# EasyEDA schematic LcsNodes-Base-Station-Board-B.00.01.json

## Sheets
1 Dual Power Module: TITLE: LcsNodes-base-Station-Board\nDual Power Unit - L6205; REV: B.00.01; Date: 2023-06-07; Sheet: 3/5; Drawn By: helmut-f; Company: Your Company
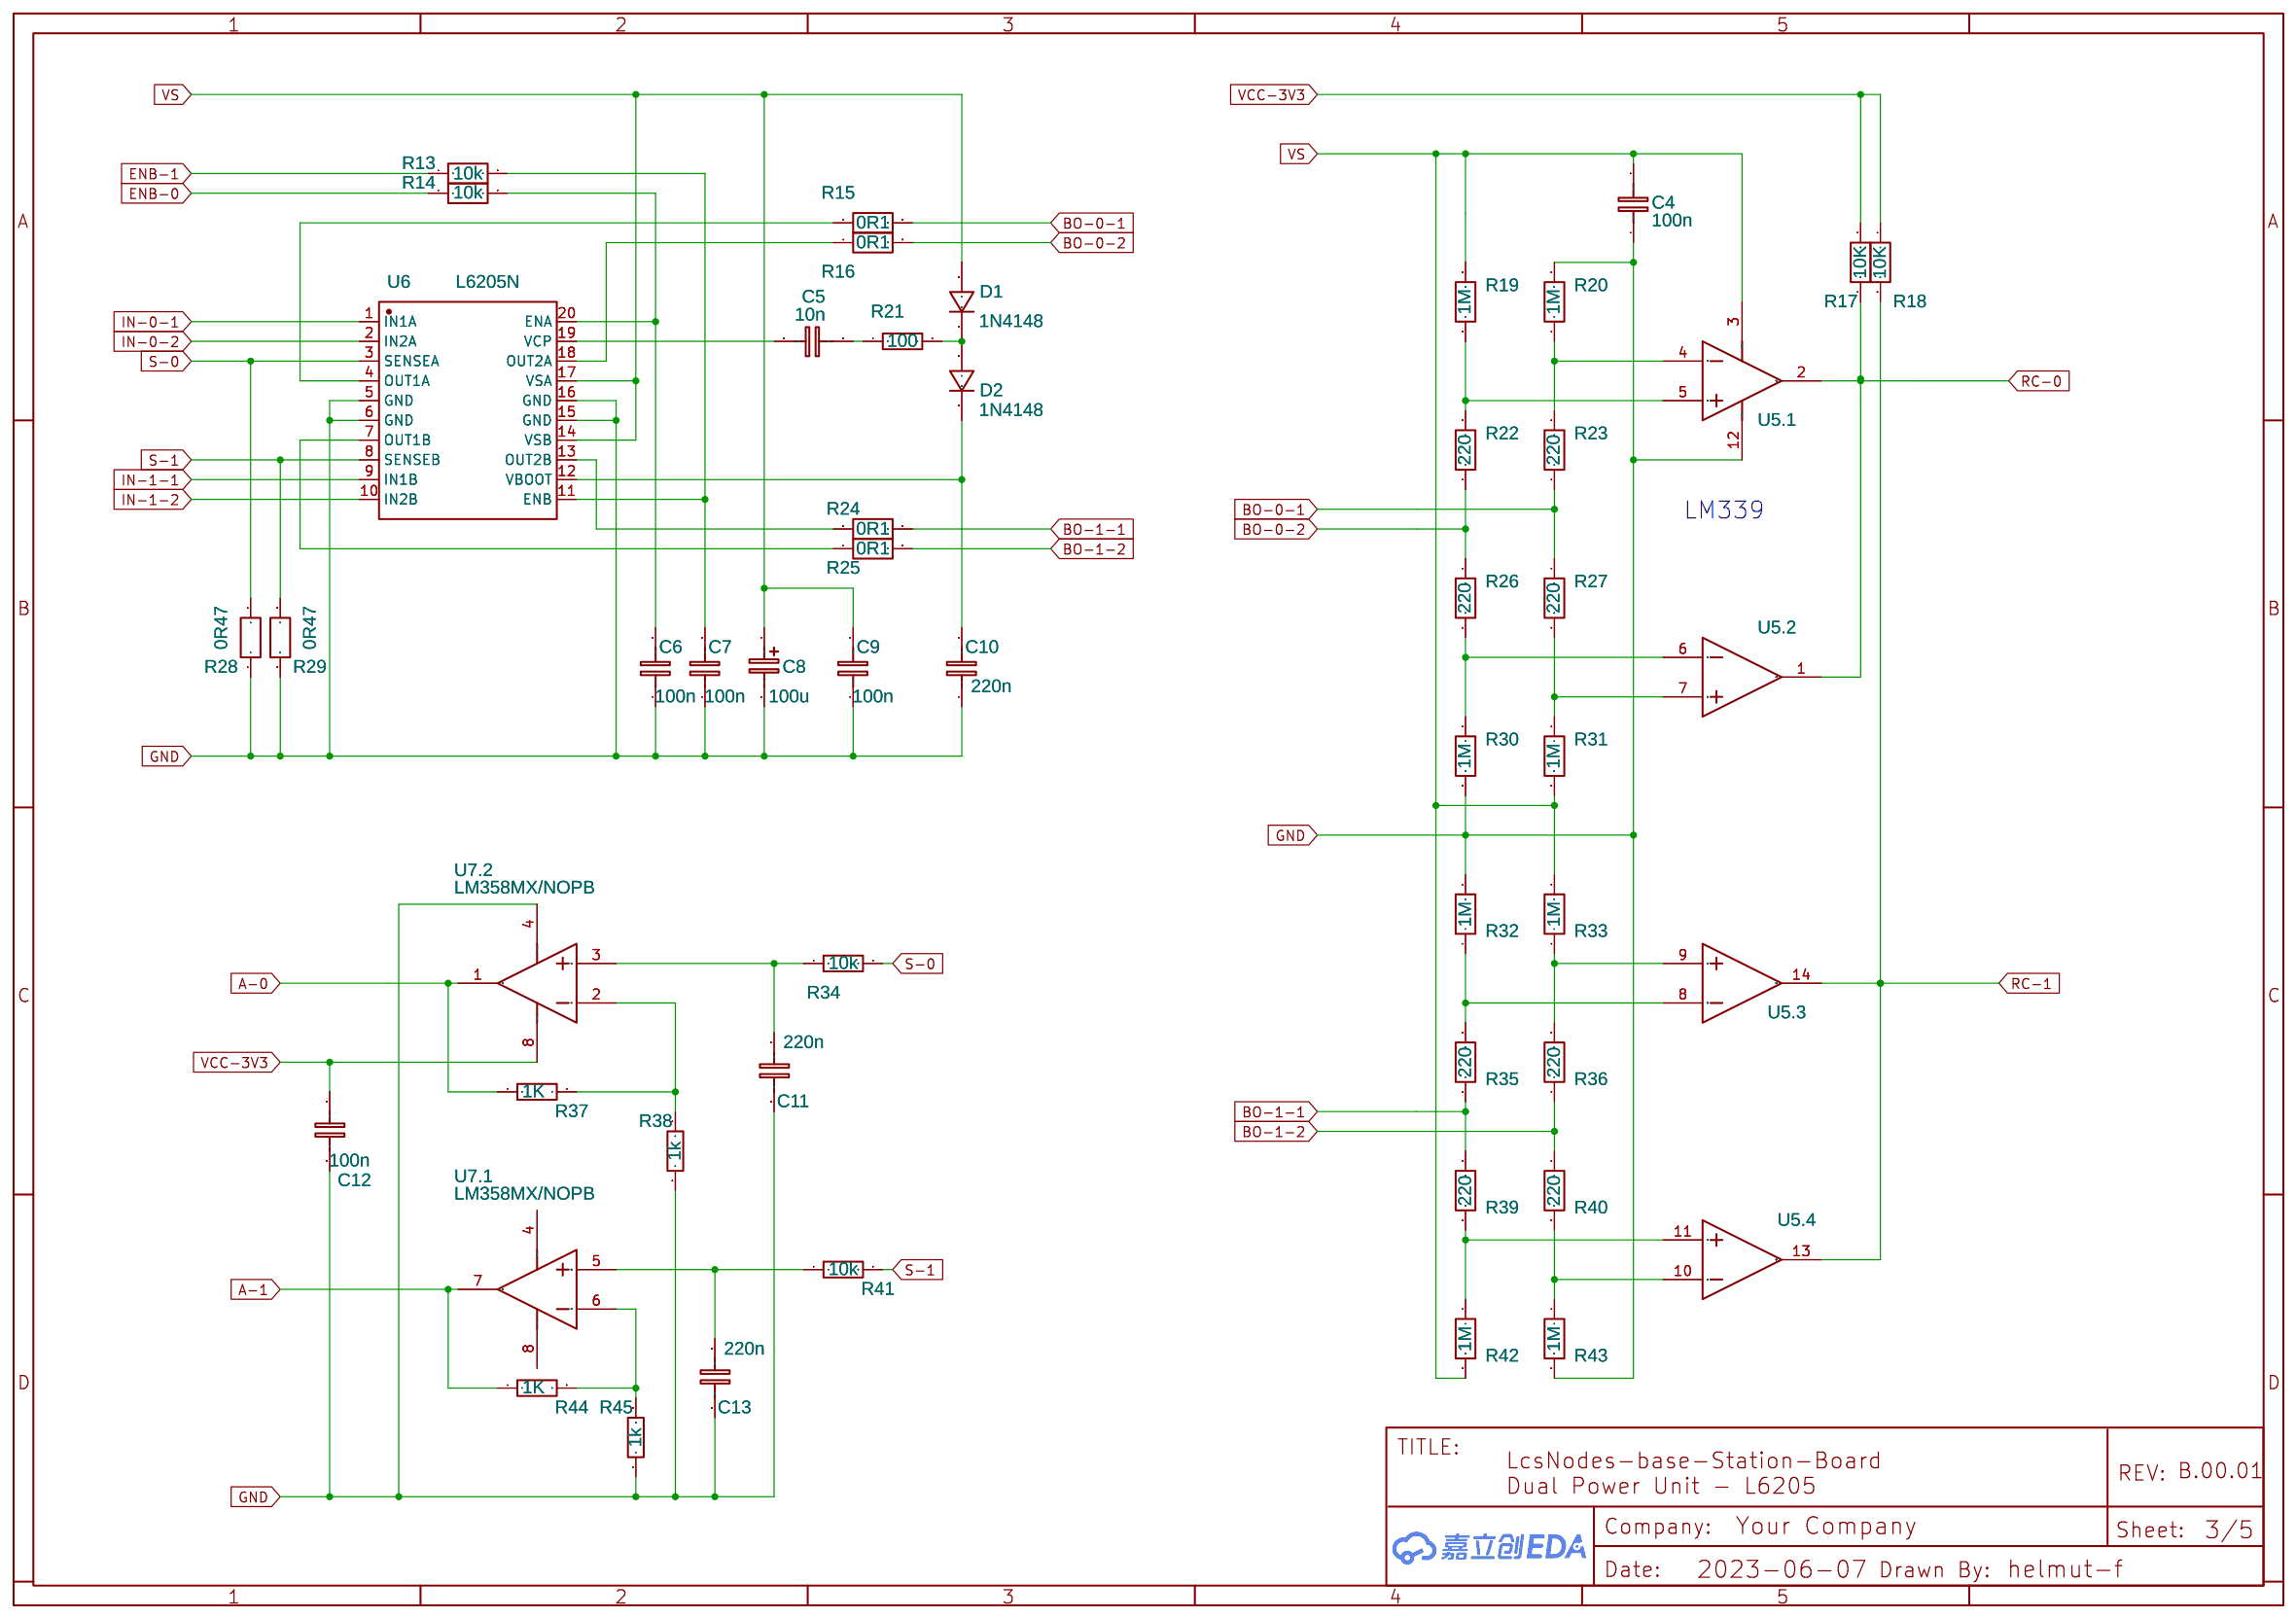
[diagram p0: Dual Power Module]
2 High Level Schematic: TITLE: LcsNodes-Base-Station-Board\nHigh Level Schematic; Sheet: 1/5
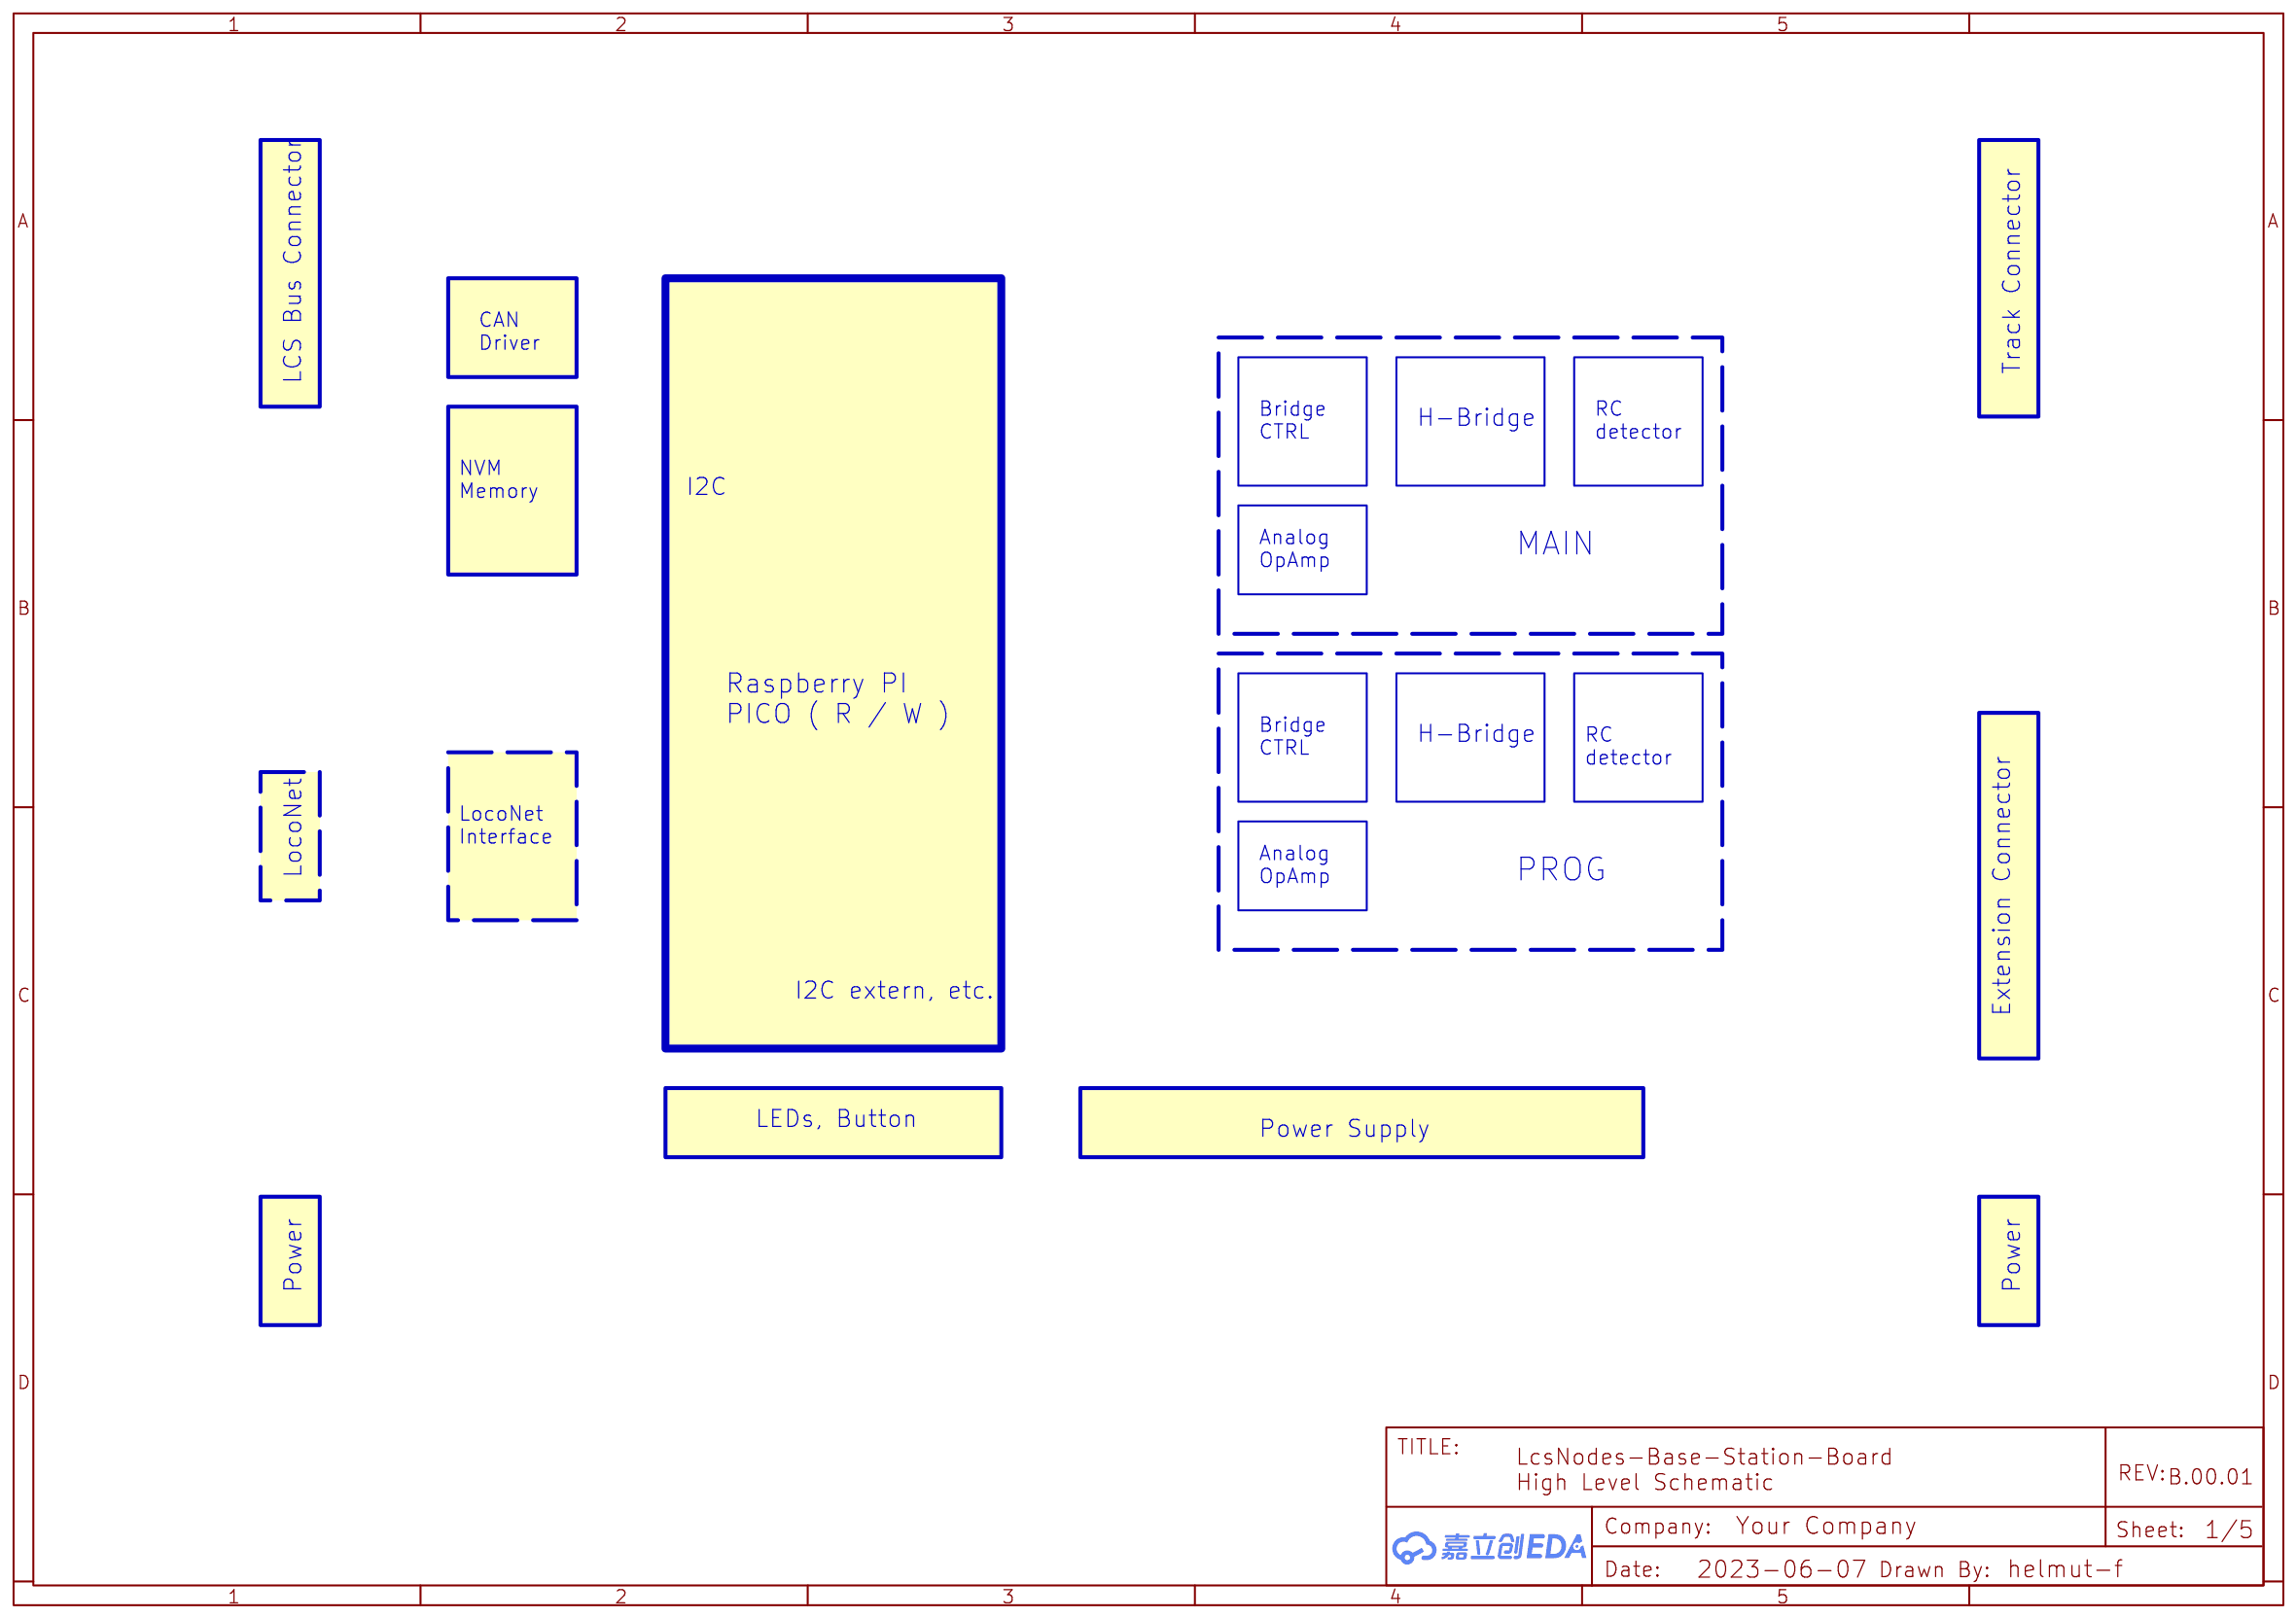
[diagram p1: High Level Schematic]
3 Controller: TITLE: LcsNodes-base-Station-Board\nLogic; Sheet: 2/5
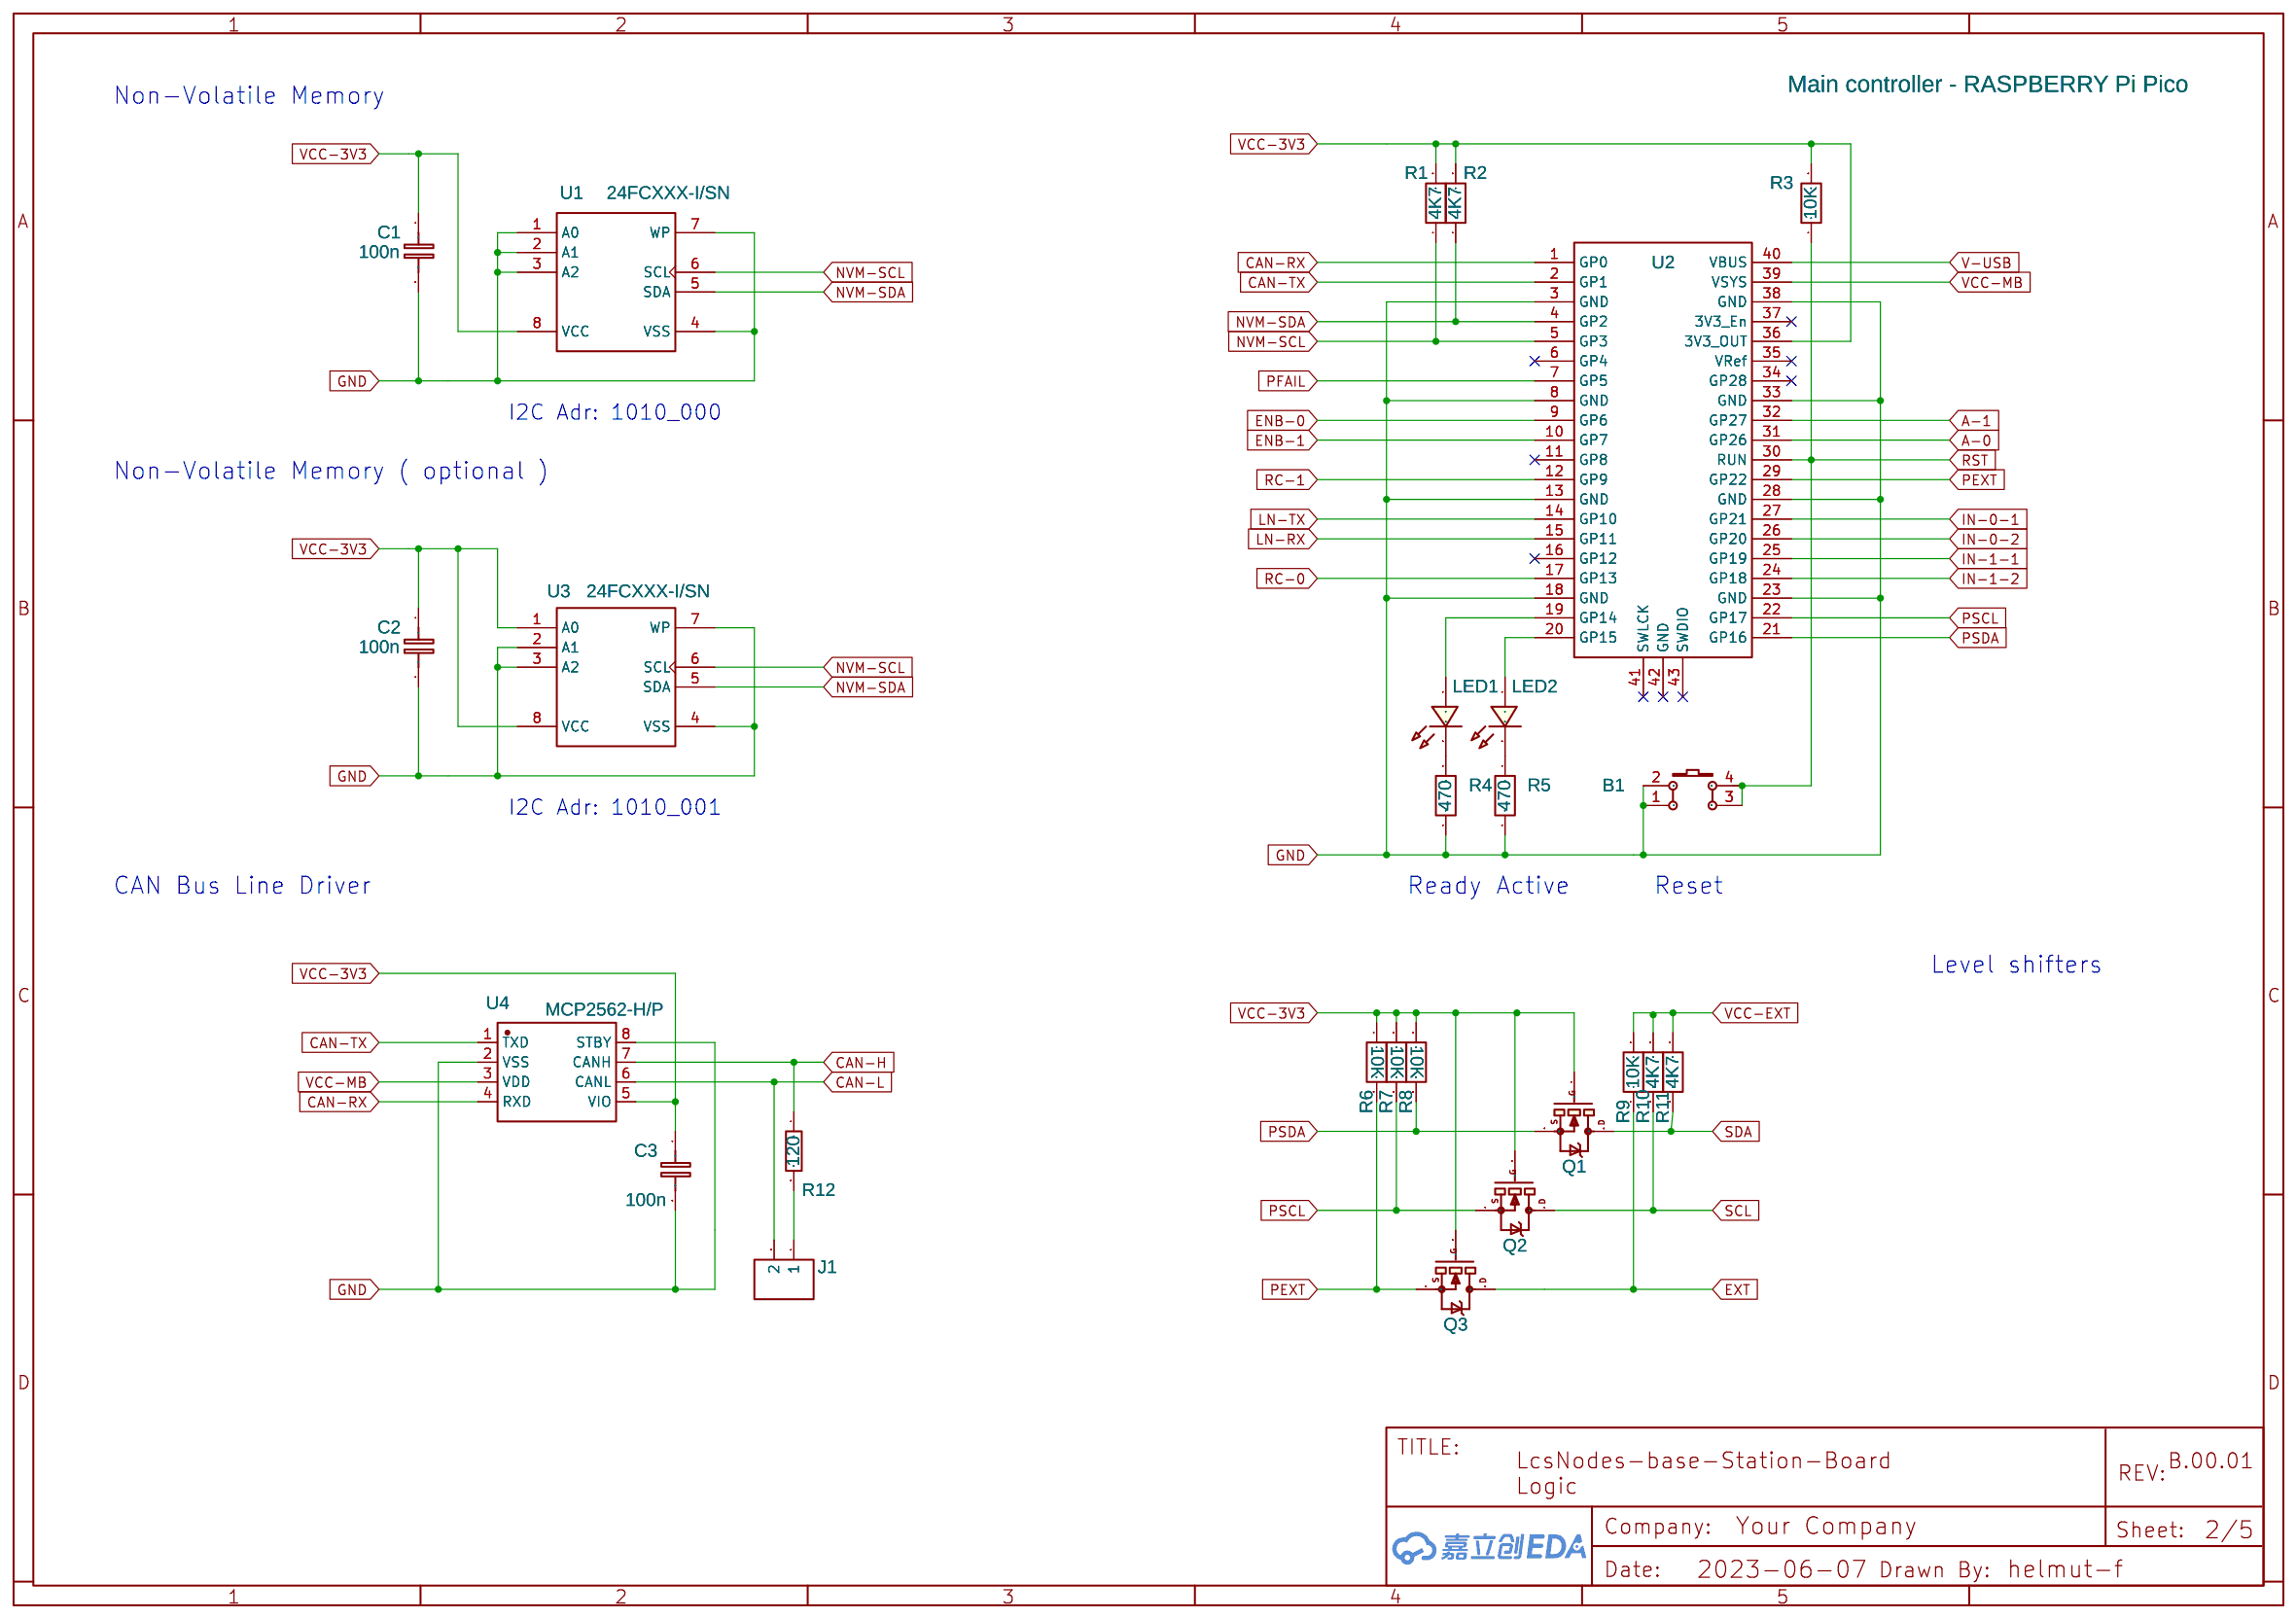
[diagram p2: Controller]
4 Connectors, Power Supply: TITLE: LcsNodes-base-Station-Board\nConnectors, Power Supply; Sheet: 5/5
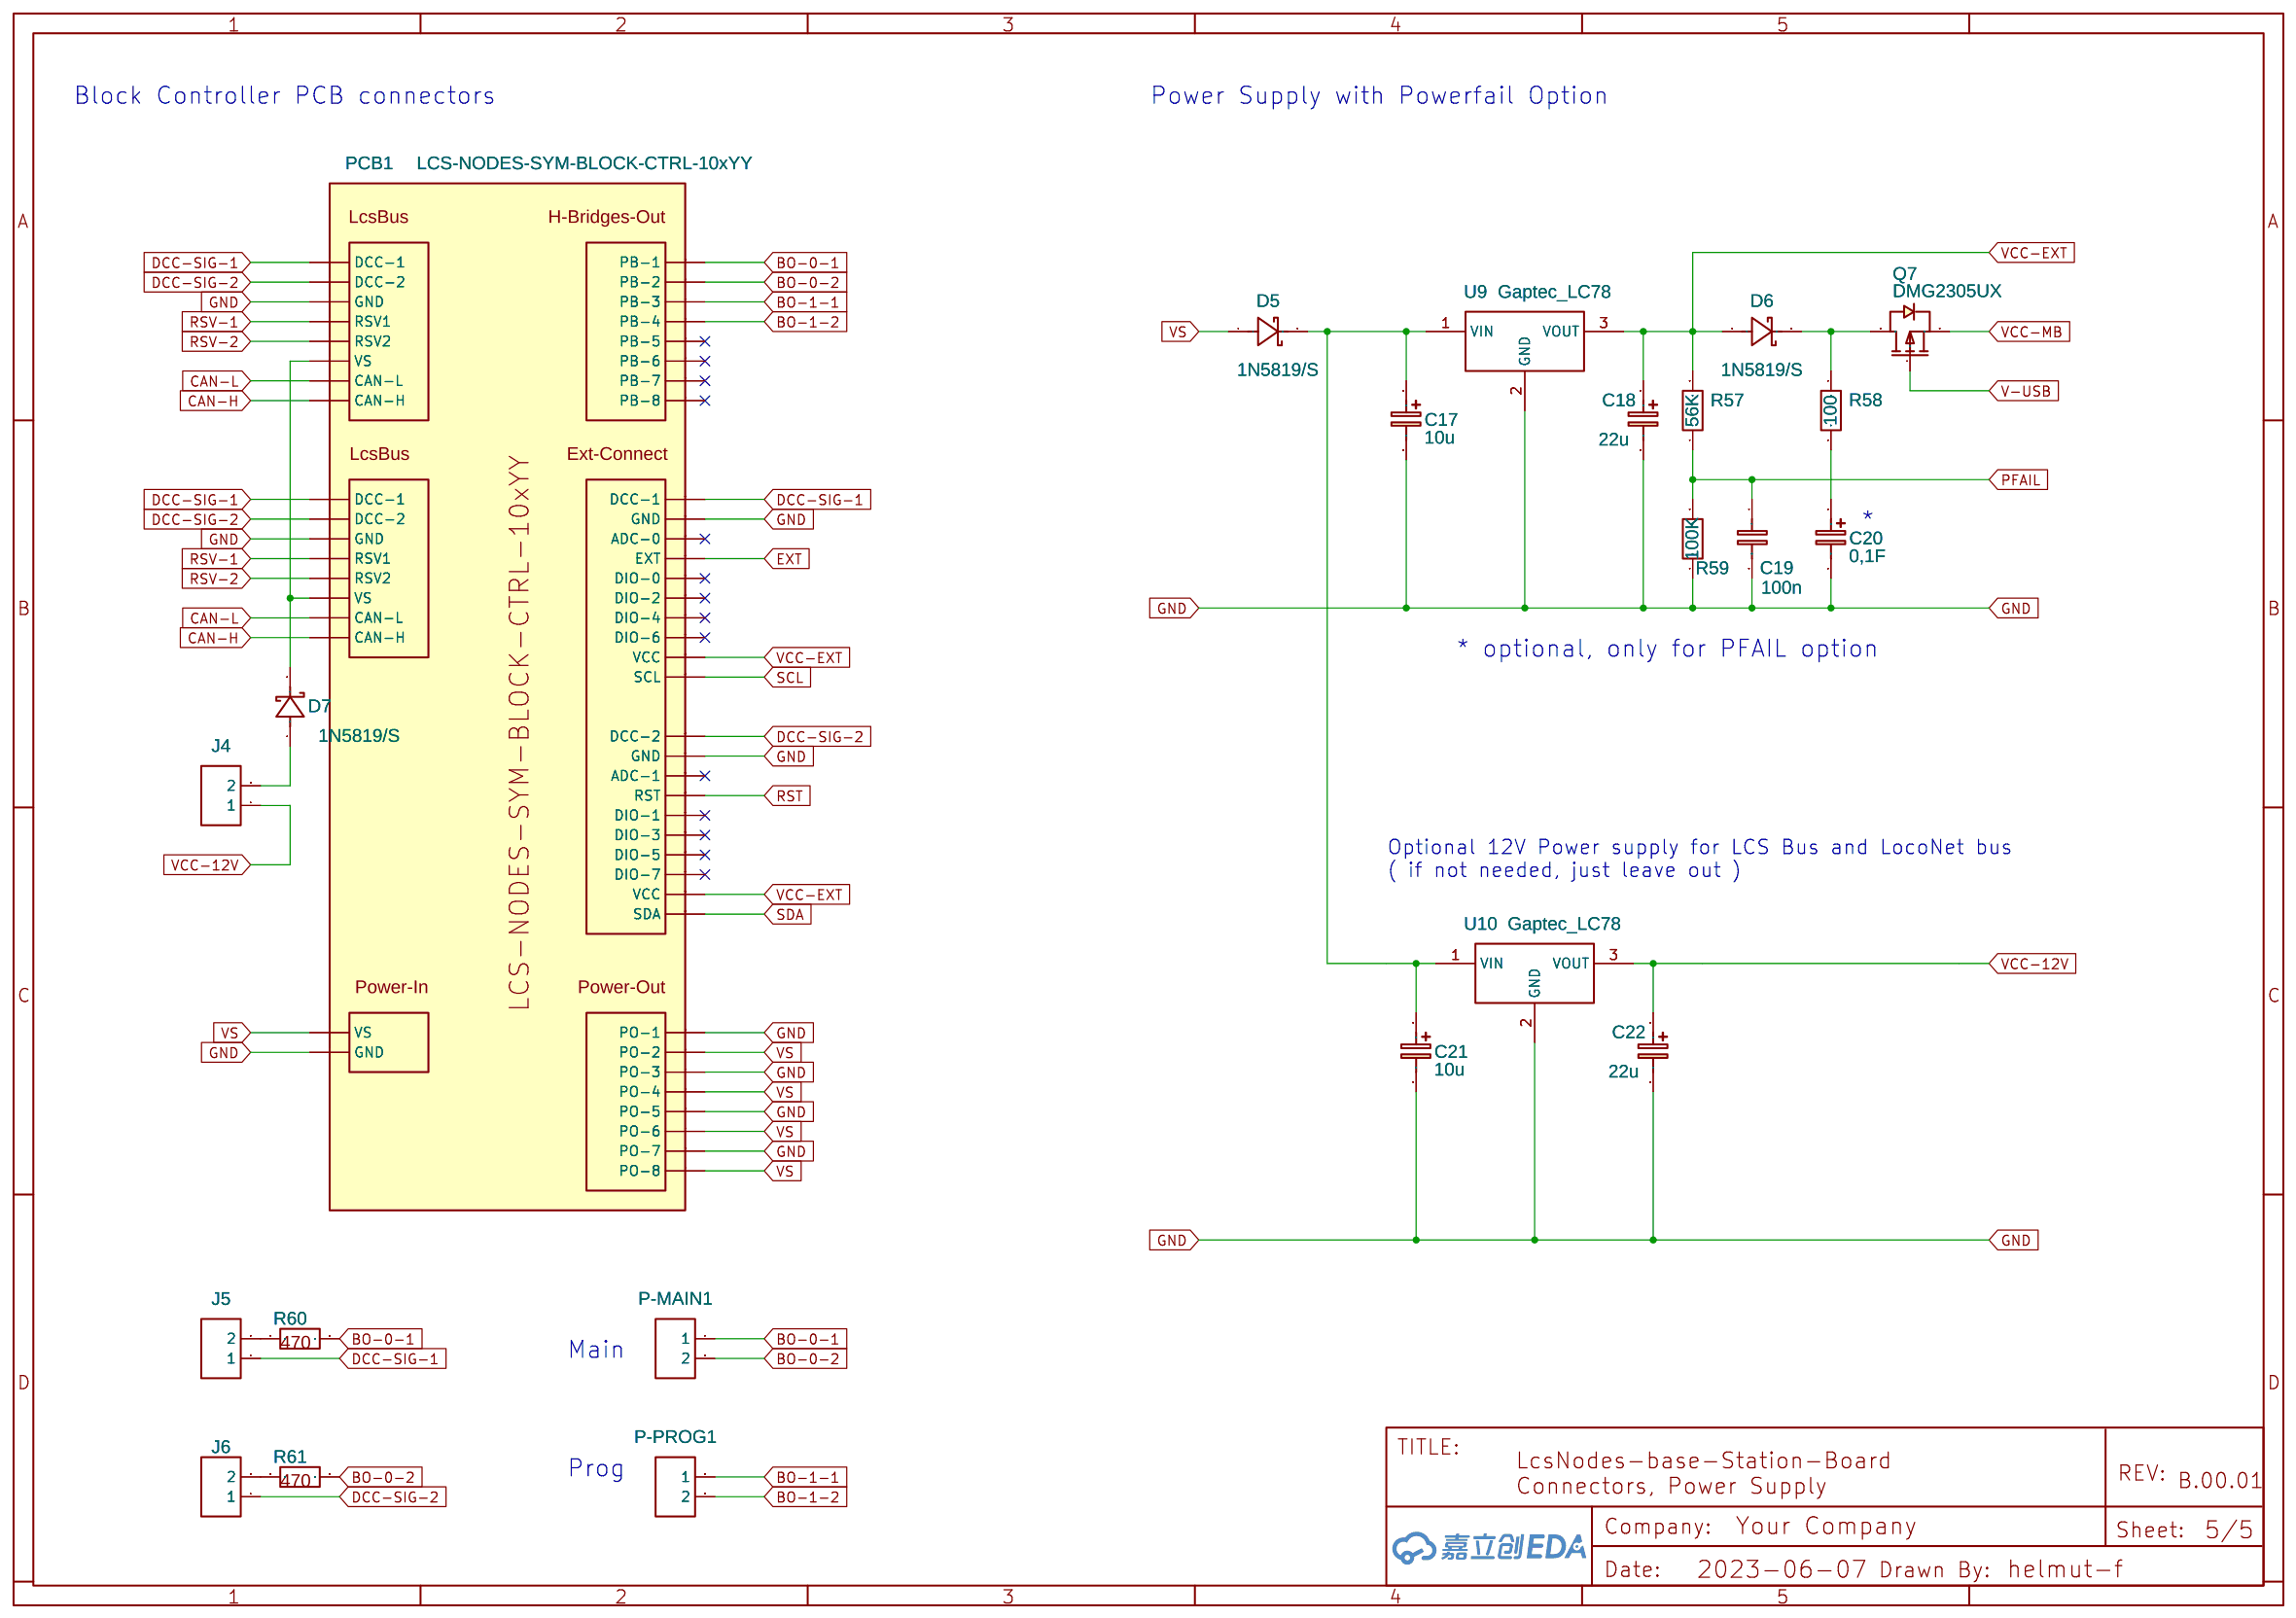
[diagram p3: Connectors, Power Supply]
5 LocoNet Interface: TITLE: LocoNet Interface; REV: 1.0; Date: 2023-09-27; Sheet: 4/5
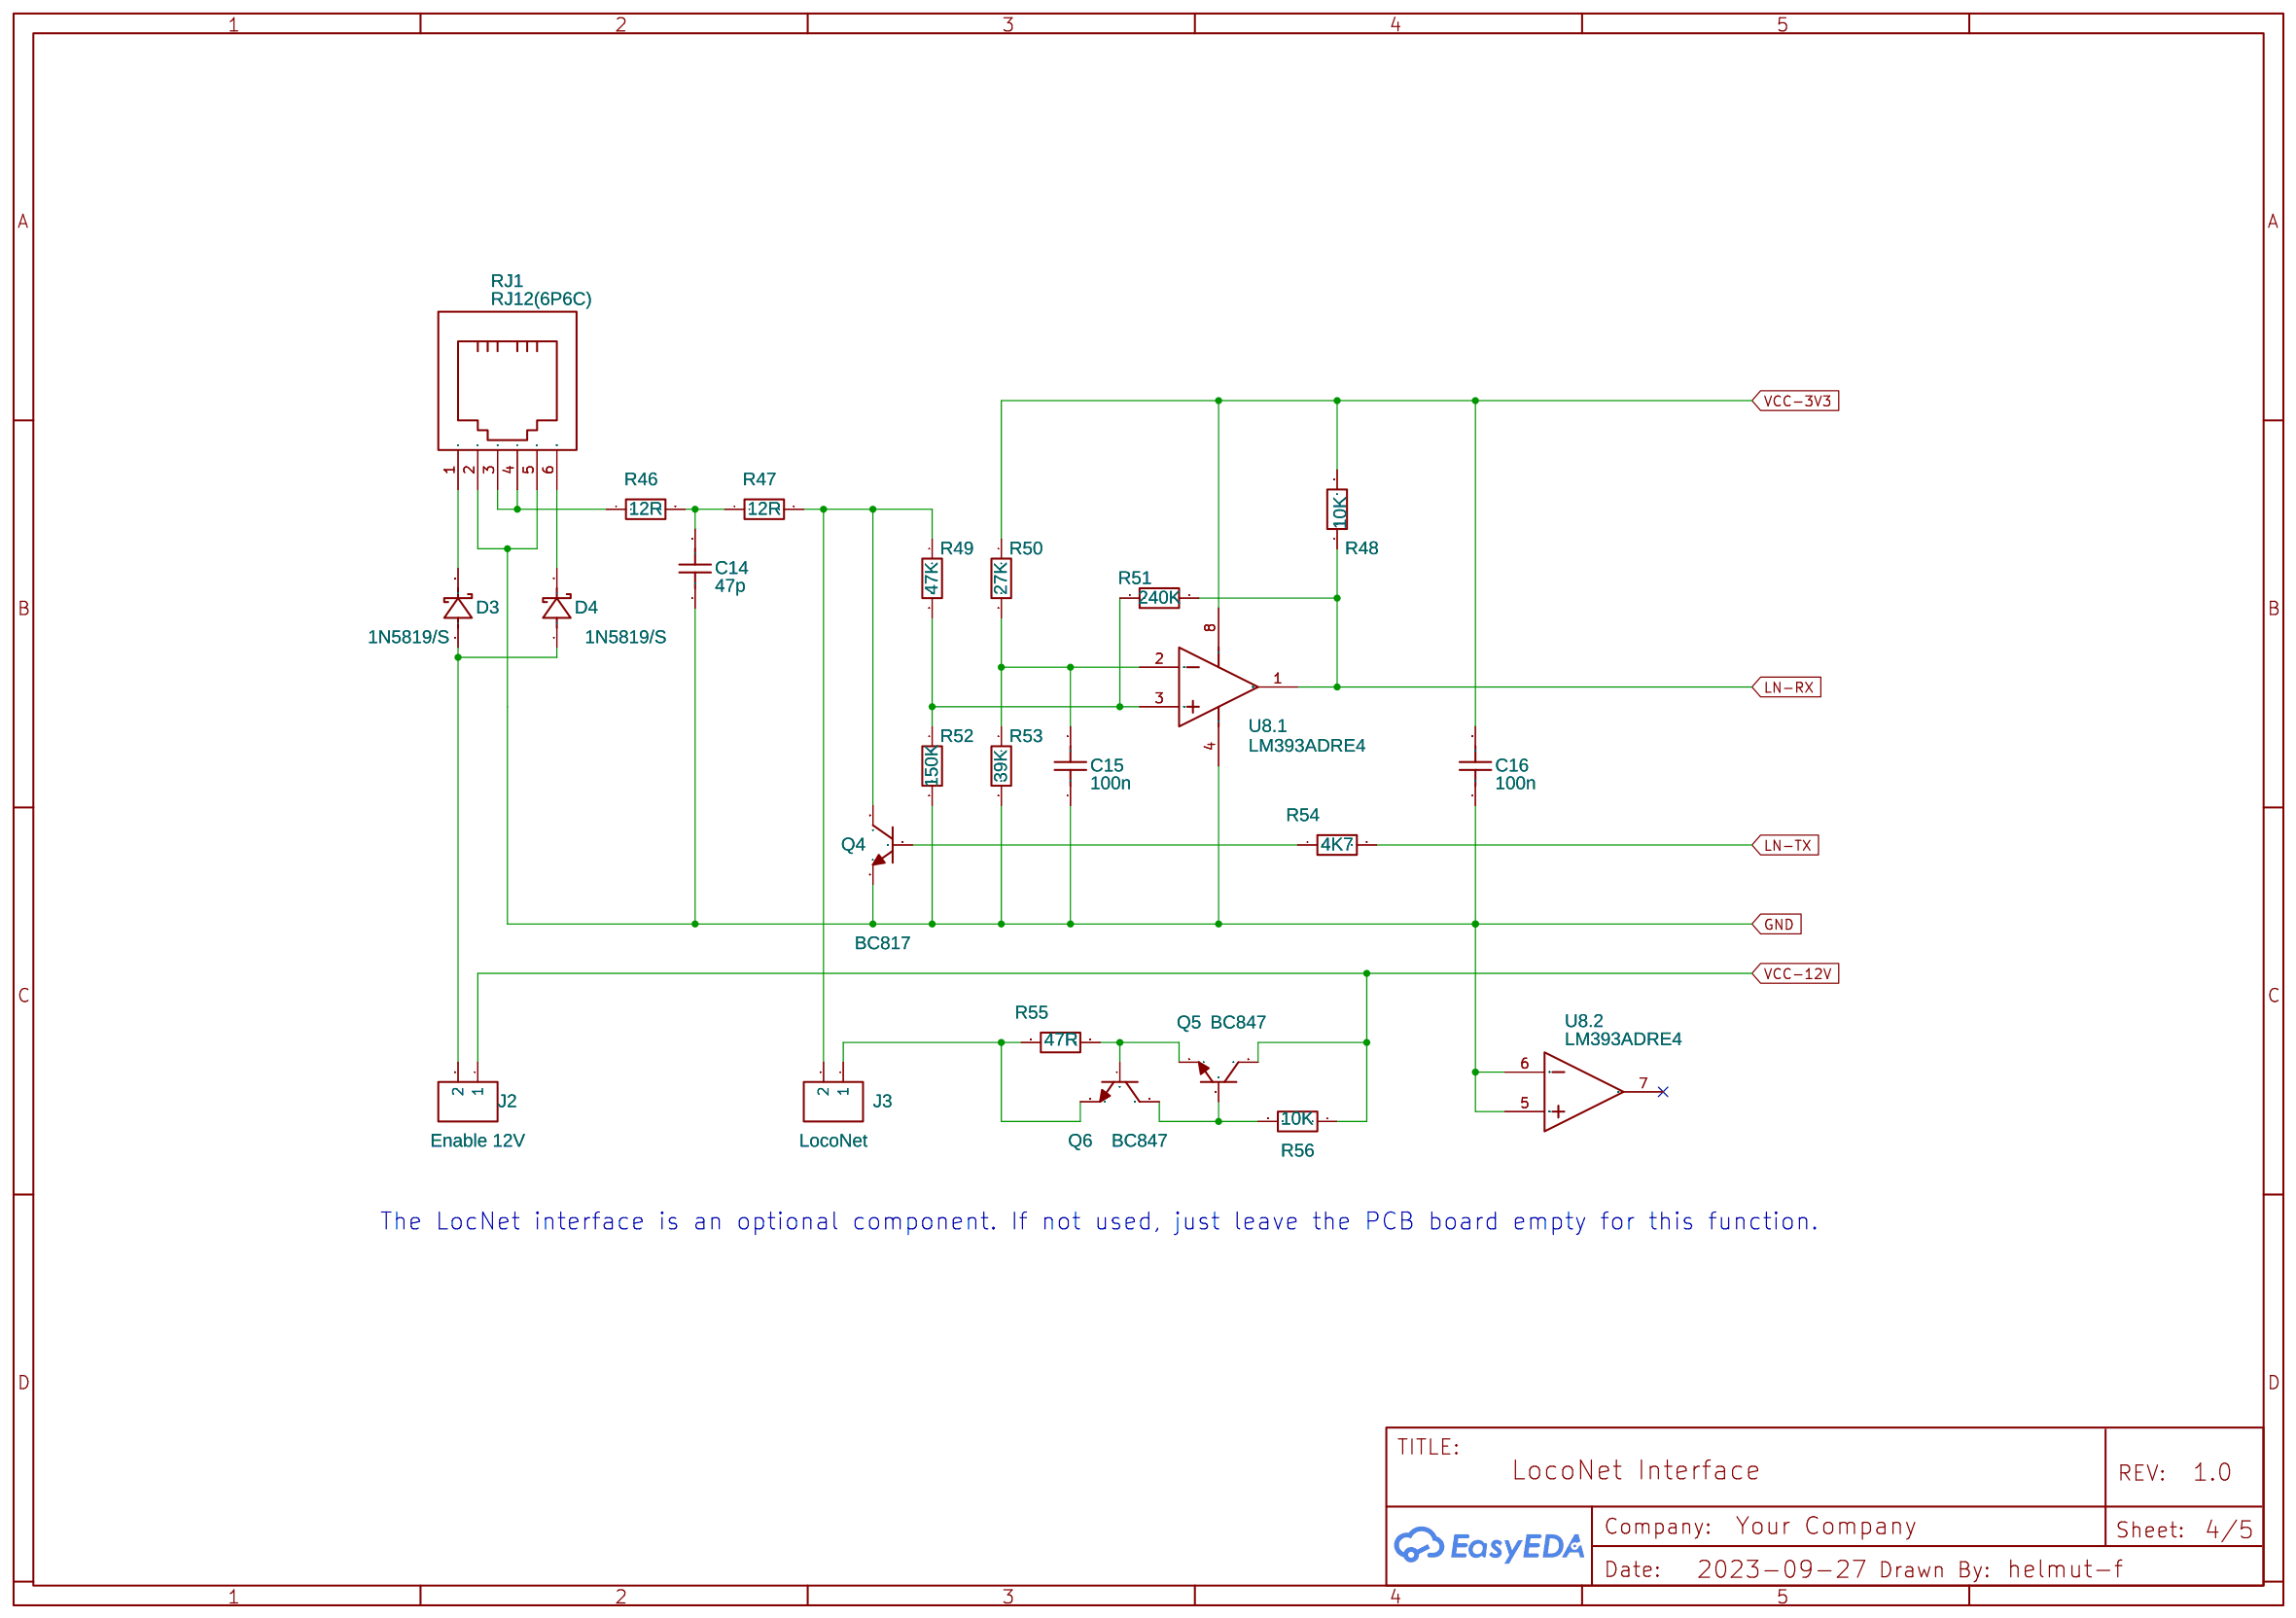
[diagram p4: LocoNet Interface]

## Parts
sheet Connectors, Power Supply
C17  10u  [CAP-D5.0×H5.5]
C18  22u  [CAP-D5.0×H5.5]
C19  100n  [C1206]
C20  0,1F  [CAP-D12.5XF5.0]
C21  10u  [CAP-D5.0×H5.5]
C22  22u  [CAP-D5.0×H5.5]
D5  1N5819/S  [SMA_L4.3-W2.6-LS5.2-R-RD]
D6  1N5819/S  [SMA_L4.3-W2.6-LS5.2-R-RD]
D7  1N5819/S  [SMA_L4.3-W2.6-LS5.2-R-RD]
J4  HDR-M-2.54_1x2  [HDR-M-2.54_1X2]
J5  HDR-M-2.54_1x2  [HDR-M-2.54_1X2]
J6  HDR-M-2.54_1x2  [HDR-M-2.54_1X2]
P-MAIN1  CONN-TH_2P-P5.08  [CONN-TH_2P-P5.08]
P-PROG1  CONN-TH_2P-P5.08  [CONN-TH_2P-P5.08]
PCB1  LCS-NODES-SYM-BLOCK-CTRL-10xYY  [LCS-NODES-FP-MAIN-CTRL-10X12]
Q7  DMG2305UX  [SOT-23-3_L2.9-W1.3-P0.95-LS2.4-BR-1]
R57  56K  [R1206]
R58  100  [R1206]
R59  100K  [R1206]
R60  470Ohm MELF resistor  [10 OHM MELF RESISTOR]
R61  10Ohm MELF resistor  [10 OHM MELF RESISTOR]
U9  Gaptec_LC78  [GAPTEC_LC78]
U10  Gaptec_LC78  [GAPTEC_LC78]
sheet Controller
B1  Opt  [SW-SMD_4P-L6.0-W6.0-P4.50-LS9.0_C23873]
C1  100n  [C1206]
C2  100n  [C1206]
C3  100n  [C1206]
J1  HDR-M-2.54_1x2  [HDR-M-2.54_1X2]
LED1  LED-0603_R  [LED-1206]
LED2  LED-0805_G  [LED-1206]
Q1  MOSFET-NCHANNELBSS138  [SOT23-3]
Q2  MOSFET-NCHANNELBSS138  [SOT23-3]
Q3  MOSFET-NCHANNELBSS138  [SOT23-3]
R1  4K7  [R1206]
R2  4K7  [R1206]
R3  10K  [R1206]
R4  470  [R1206]
R5  470  [R1206]
R6  10K  [R1206]
R7  10K  [R1206]
R8  10K  [R1206]
R9  10K  [R1206]
R10  4K7  [R1206]
R11  4K7  [R1206]
R12  120  [R1206]
U1  24FCXXX-I/SN  [SOIC-8_L4.9-W3.9-P1.27-LS6.0-BL]
U2  Main controller - RASPBERRY Pi Pico  [RASPBERRY PI PICO]
U3  24FCXXX-I/SN  [SOIC-8_L4.9-W3.9-P1.27-LS6.0-BL]
U4  MCP2562-H/P  [SOIC-8_L4.9-W3.9-P1.27-LS6.1-BL]
sheet Dual Power Module
C4  100n  [C1206]
C5  10n  [C1206]
C6  100n  [C1206]
C7  100n  [C1206]
C8  100u  [CAP-D6.3×H7.7]
C9  100n  [C1206]
C10  220n  [C1206]
C11  220n  [C1206]
C12  100n  [C1206]
C13  220n  [C1206]
D1  1N4148  [SOD-80C_L3.3-W1.5-RD]
D2  1N4148  [SOD-80C_L3.3-W1.5-RD]
R13  10k  [R1206]
R14  10k  [R1206]
R15  0R1  [R_AXIAL-0.8]
R16  0R1  [R_AXIAL-0.8]
R17  10K  [R1206]
R18  10K  [R1206]
R19  1M  [R1206]
R20  1M  [R1206]
R21  100  [R1206]
R22  220  [R1206]
R23  220  [R1206]
R24  0R1  [R_AXIAL-0.8]
R25  0R1  [R_AXIAL-0.8]
R26  220  [R1206]
R27  220  [R1206]
R28  0R47  [R_AXIAL-0.8]
R29  0R47  [R_AXIAL-0.8]
R30  1M  [R1206]
R31  1M  [R1206]
R32  1M  [R1206]
R33  1M  [R1206]
R34  10k  [R1206]
R35  220  [R1206]
R36  220  [R1206]
R37  1K  [R1206]
R38  1k  [R1206]
R39  220  [R1206]
R40  220  [R1206]
R41  10k  [R1206]
R42  1M  [R1206]
R43  1M  [R1206]
R44  1K  [R1206]
R45  1k  [R1206]
U5  LM339ADR  [SO-14_L8.6-W3.9-P1.27-LS6.0-BL]  (sections 1,2,3,4)
U6  L6205N  [PDIP-20_L24.5-W7.3-P2.54-LS7.9-BL]
U7  LM358MX/NOPB  [SOIC-8_L4.9-W3.9-P1.27-LS6.0-BL]  (sections 1,2)
sheet LocoNet Interface
C14  47p  [C1206]
C15  100n  [C1206]
C16  100n  [C1206]
D3  1N5819/S  [SMA_L4.3-W2.6-LS5.2-R-RD]
D4  1N5819/S  [SMA_L4.3-W2.6-LS5.2-R-RD]
J2  Enable 12V  [HDR-M-2.54_1X2]
J3  LocoNet  [HDR-M-2.54_1X2]
Q4  BC817  [SOT-23-3_L2.9-W1.3-P1.90-LS2.4-BR]
Q5  BC847  [SOT-323-3_L2.0-W1.3-P1.30-LS2.1-BR]
Q6  BC847  [SOT-323-3_L2.0-W1.3-P1.30-LS2.1-BR]
R46  12R  [R1206]
R47  12R  [R1206]
R48  10K  [R1206]
R49  47K  [R1206]
R50  27K  [R1206]
R51  240K  [R1206]
R52  150K  [R1206]
R53  39K  [R1206]
R54  4K7  [R1206]
R55  47R  [R1206]
R56  10K  [R1206]
RJ1  RJ12(6P6C)  [RJ12-TH_6P6C]
U8  LM393ADRE4  [SOIC-8_L4.9-W3.9-P1.27-LS6.0-BL]  (sections 1,2)

## Library data of the parts
C8 C17 C18 C21 C22 = CE_SMD_D5.0×H5.5_EU: Contributor: LCEDA_Lib
C19 = C_RAD-0.2_EU: Contributor: LCEDA_Lib
C20 = C_Tan_SMD_A_EU: Contributor: LCEDA_Lib
D3-D7 = 1N5819/S: Supplier: LCSC; Supplier Part: C9900003833; JLCPCB Part Class: Extended Part; Contributor: LCSC
J1-J6 = HDR-M-2.54_1x2: Supplier Part: C124375; Supplier: LCSC; Contributor: LCEDA_Lib
P-MAIN1 P-PROG1 = CONN-TH_2P-P5.08: Supplier: LCSC; Contributor: LCEDA_Lib
PCB1 = LCS-NODES-SYM-BLOCK-CTRL-10X16: Contributor: helmut-f; Package Display: No
Q7 = DMG2305UX: Supplier: LCSC; Supplier Part: C2940629; Manufacturer: TECH PUBLIC(台舟); link: https://atta.szlcsc.com//upload/public/pdf/source/20220124/672A40BC72F4DE27873D6595D2E3AF1A.pdf; Contributor: LCSC; JLCPCB Part Class: Extended Part
R13 R14 R16-R20 R22-R27 R30-R33 R35 R36 R39 R40 R42 R43 R57-R59 = R_AXIAL-0.3_EU: Contributor: LCEDA_Lib
R60 R61 = 10Ohm MELF resistor: Contributor: hi10
U9 U10 = Gaptec_LC78: Contributor: SpicyMemeBoi; Package Display: No
B1 = K4-6×6_TH: Supplier: LCSC; Supplier Part: C136684; Manufacturer: 韩国韩荣; Manufacturer Part: K2-1102DP-E4SW-04; Contributor: LCEDA_Lib; Package Display: No
C1-C4 C11-C13 = C_0603_EU: Contributor: LCEDA_Lib; Package Display: No
LED1 = LED-0603_R: Manufacturer: EVERLIGHT(台湾亿光); Manufacturer Part: 19-217/R6C-AL1M2VY/3T; Supplier Part: C72044; Supplier: LCSC; Contributor: LCEDA_01
LED2 = LED-0805_G: Manufacturer: 国星光电; Manufacturer Part: NCD0805G1; Supplier Part: C84260; Contributor: LCEDA_Lib
Q1-Q3 = MOSFET-NCHANNELBSS138: Common NMOSFET Parts; Contributor: SparkFun
R1-R11 = R_0805_EU: Contributor: LCEDA_Lib
R12 R21 R34 R37 R38 R41 R44 R45 = RESISTOR-AXIAL-0.1
U1 U3 = 24FC256-I/SN: Supplier: LCSC; Manufacturer: MICROCHIP(美国微芯); Contributor: LCSC; Supplier Part: C145385; JLCPCB Part Class: Extended Part
U2 = RASPBERRY Pi Pico Through Holes: Contributor: untung91
U4 = MCP2562-H/P: Supplier: LCSC; Supplier Part: C640348; Manufacturer: MICROCHIP(美国微芯); link: https://atta.szlcsc.comnull; Contributor: lcsc
C5-C7 C9 C10 = C_0603_EU: Contributor: LCEDA_Lib
D1 = 1N4148: Supplier: LCSC; Manufacturer: SEMTECH; Supplier Part: C14516; Contributor: LCEDA_Lib
D2 = 1N4148: Supplier: LCSC; Manufacturer: SEMTECH; Supplier Part: C14516; Contributor: LCEDA_Lib; Package Display: No
R15 = R_AXIAL-0.3_EU: Contributor: LCEDA_Lib; Package Display: No
R28 R29 = R_AXIAL-0.5_EU: Contributor: LCEDA_Lib; Package Display: No
U5 = LM339ADR: Supplier Part: C74559; Supplier: LCSC; Manufacturer Part: TI; subpart_no: 1; JLCPCB Part Class: Extended Part
U6 = L6205N: Supplier: LCSC; Supplier Part: C962260; Manufacturer: STMicroelectronics; Contributor: LCSC
U7 = LM358MX/NOPB: subpart_no: 1; image: http://image.lceda.cn/szlcsc/C16416.jpg; Supplier Part: C16416; Supplier: LCSC; Manufacturer: TI(德州仪器); JLCPCB Part Class: Extended Part; link: https://lcsc.com/eda_search?q=C16416&%26type=1&ref=editor
C14-C16 = CT41G-1206-X5R-50V-10UF-M(N): Supplier: LCSC; Supplier Part: C9900007291; Manufacturer: null; Manufacturer Part: CT41G-1206-X5R-50V-10uF-M(N); link: https://atta.szlcsc.comnull; JLCPCB Part Class: Extended Part; Contributor: lcsc
Q4 = BC817-40: Supplier: LCSC; Manufacturer: Hottech(合科泰); Contributor: LCSC; Supplier Part: C181151; JLCPCB Part Class: Extended Part
Q5 Q6 = BC847CW-QBC847CW-QXX: Supplier: LCSC; Supplier Part: C5182829; Manufacturer: Nexperia(安世); link: https://atta.szlcsc.com/upload/public/pdf/source/20220920/079F28AA67300DB8DEDEEFA28BB33B43.pdf; Contributor: lcsc; JLCPCB Part Class: Extended Part
R46-R56 = HVF1206T5002FET: Supplier: LCSC; Supplier Part: C4087637; Manufacturer: Ohmite; link: https://atta.szlcsc.comnull; Contributor: lcsc
RJ1 = RJ12(6P6C): Contributor: yulin0826
U8 = LM393ADRE4: Supplier: LCSC; Supplier Part: C3659061; Manufacturer: TI(德州仪器); link: https://atta.szlcsc.com/upload/public/pdf/source/20230221/4AD22C75DCC6447290BC7CE521BA2EAE.pdf; subpart_no: 1

## Nets
GND: B1.1 B1.2 C1.2 C2.2 C3.2 C4.1 C6.1 C7.1 C8.2 C9.1 C10.1 C11.2 C12.2 C13.2 C14.1 C15.1 C16.1 C17.2 C18.2 C19.2 C20.2 C21.2 C22.2 PCB1.3(GND) PCB1.13(GND) PCB1.21(GND) PCB1.51(GND) PCB1.61(GND) PCB1.70(PO-1) PCB1.71(PO-3) PCB1.72(PO-5) PCB1.73(PO-7) Q4.2 R4.2 R5.2 R20.2 R28.1 R29.1 R30.2 R32.2 R38.1 R43.2 R45.1 R52.2 R53.2 R59.1 RJ1.2 RJ1.5 U1.1(A0) U1.2(A1) U1.3(A2) U1.4(VSS) U1.7(WP) U2.3(GND) U2.8(GND) U2.13(GND) U2.18(GND) U2.23(GND) U2.28(GND) U2.33(GND) U2.38(GND) U3.2(A1) U3.3(A2) U3.4(VSS) U3.7(WP) U4.2(VSS) U4.8(STBY) U5.12(GND) U6.5(GND) U6.6(GND) U6.15(GND) U6.16(GND) U7.4(GND) U8.4(GND) U8.5(2IN+) U8.6(2IN-) U9.2(GND) U10.2(GND)
VCC-3V3: C1.1 C2.1 C3.1 C12.1 C16.2 Q1.1(G) Q2.1(G) Q3.1(G) R1.2 R2.2 R3.2 R6.1 R7.1 R8.1 R17.2 R18.1 R48.2 R50.1 U1.8(VCC) U2.36(3V3_OUT) U3.1(A0) U3.8(VCC) U4.5(VIO) U7.8(V+) U8.8(VDD)
VCC-12V: C22.1 J2.1 J4.1 Q5.3(C) R56.1 U10.3(VOUT)
VCC-EXT: C18.1 D6.1(A) PCB1.58(VCC) PCB1.68(VCC) R9.2 R10.2 R11.2 R57.2 U9.3(VOUT)
VCC-MB: Q7.2(S) U2.39(VSYS) U4.3(VDD)
A-0: R37.1 U2.31(GP26) U7.1(OUTA)
A-1: R44.1 U2.32(GP27) U7.7(OUTB)
BO-0-1: P-MAIN1.1 PCB1.40(PB-1) R15.2 R23.1 R27.1 R60.2
BO-0-2: P-MAIN1.2 PCB1.44(PB-2) R16.2 R22.1 R26.1 R61.2
BO-1-1: P-PROG1.1 PCB1.41(PB-3) R24.2 R35.1 R39.1
BO-1-2: P-PROG1.2 PCB1.45(PB-4) R25.2 R36.1 R40.1
CAN-H: PCB1.8(CAN-H) PCB1.18(CAN-H) R12.1 U4.7(CANH)
CAN-L: J1.2 PCB1.7(CAN-L) PCB1.17(CAN-L) U4.6(CANL)
CAN-RX: U2.1(GP0) U4.4(RXD)
CAN-TX: U2.2(GP1) U4.1(TXD)
DCC-SIG-1: J5.1 PCB1.1(DCC-1) PCB1.11(DCC-1) PCB1.50(DCC-1)
DCC-SIG-2: J6.1 PCB1.2(DCC-2) PCB1.12(DCC-2) PCB1.60(DCC-2)
ENB-0: R14.1 U2.9(GP6)
ENB-1: R13.1 U2.10(GP7)
EXT: PCB1.53(EXT) Q3.3(D) R9.1
IN-0-1: U2.27(GP21) U6.1(IN1A)
IN-0-2: U2.26(GP20) U6.2(IN2A)
IN-1-1: U2.25(GP19) U6.9(IN1B)
IN-1-2: U2.24(GP18) U6.10(IN2B)
LN-RX: R48.1 R51.2 U2.15(GP11) U8.1(1OUT)
LN-TX: R54.2 U2.14(GP10)
NVM-SCL: R1.1 U1.6(SCL) U2.5(GP3) U3.6(SCL)
NVM-SDA: R2.1 U1.5(SDA) U2.4(GP2) U3.5(SDA)
PEXT: Q3.2(S) R6.2 U2.29(GP22)
PFAIL: C19.1 R57.1 R59.2 U2.7(GP5)
PSCL: Q2.2(S) R7.2 U2.22(GP17)
PSDA: Q1.2(S) R8.2 U2.21(GP16)
RC-0: R17.1 U2.17(GP13) U5.1(OUT1) U5.2(OUT2)
RC-1: R18.2 U2.12(GP9) U5.13(OUT4) U5.14(OUT3)
RST: B1.3 B1.4 PCB1.63(RST) R3.1 U2.30(RUN)
RSV-1: PCB1.4(RSV1) PCB1.14(RSV1)
RSV-2: PCB1.5(RSV2) PCB1.15(RSV2)
S-0: R28.2 R34.2 U6.3(SENSEA)
S-1: R29.2 R41.2 U6.8(SENSEB)
SCL: PCB1.59(SCL) Q2.3(D) R10.1
SDA: PCB1.69(SDA) Q1.3(D) R11.1
V-USB: Q7.1(G) U2.40(VBUS)
VS: C4.2 C8.1 C9.2 D1.2(1) D5.1(A) PCB1.20(VS) PCB1.74(PO-2) PCB1.75(PO-4) PCB1.76(PO-6) PCB1.77(PO-8) R19.2 R31.2 R33.2 R42.2 U5.3(VCC) U6.14(VSB) U6.17(VSA)
Net-(C5-1): C5.1 U6.19(VCP)
Net-(C5-2): C5.2 R21.1
Net-(C6-2): C6.2 R14.2 U6.20(ENA)
Net-(C7-2): C7.2 R13.2 U6.11(ENB)
Net-(C10-2): C10.2 D2.1(2) U6.12(VBOOT)
Net-(C11-1): C11.1 R34.1 U7.3(INA+)
Net-(C13-1): C13.1 R41.1 U7.5(INB+)
Net-(C14-2): C14.2 R46.2 R47.1
Net-(C15-2): C15.2 R50.2 R53.1 U8.2(1IN-)
Net-(C17-1): C17.1 C21.1 D5.2(K) U9.1(VIN) U10.1(VIN)
Net-(C20-1): C20.1 R58.2
Net-(D1-1): D1.1(2) D2.2(1) R21.2
Net-(D3-1): D3.1(A) D4.1(A) J2.2
Net-(D3-2): D3.2(K) RJ1.1
Net-(D4-2): D4.2(K) RJ1.6
Net-(D6-2): D6.2(K) Q7.3(D) R58.1
Net-(D7-1): D7.1(A) J4.2
Net-(D7-2): D7.2(K) PCB1.6(VS) PCB1.16(VS)
Net-(J1-1): J1.1 R12.2
Net-(J3-1): J3.1 Q6.2(E) R55.2
Net-(J3-2): J3.2 Q4.3 R47.2 R49.1
Net-(J5-2): J5.2 R60.1
Net-(J6-2): J6.2 R61.1
Net-(LED1-1): LED1.1 U2.19(GP14)
Net-(LED1-2): LED1.2 R4.1
Net-(LED2-1): LED2.1 U2.20(GP15)
Net-(LED2-2): LED2.2 R5.1
Net-(Q4-1): Q4.1 R54.1
Net-(Q5-1): Q5.1(B) Q6.3(C) R56.2
Net-(Q5-2): Q5.2(E) Q6.1(B) R55.1
Net-(R15-1): R15.1 U6.4(OUT1A)
Net-(R16-1): R16.1 U6.18(OUT2A)
Net-(R19-1): R19.1 R22.2 U5.5(IN2+)
Net-(R20-1): R20.1 R23.2 U5.4(IN2-)
Net-(R24-1): R24.1 U6.13(OUT2B)
Net-(R25-1): R25.1 U6.7(OUT1B)
Net-(R26-2): R26.2 R30.1 U5.6(IN1-)
Net-(R27-2): R27.2 R31.1 U5.7(IN1+)
Net-(R32-1): R32.1 R35.2 U5.8(IN3-)
Net-(R33-1): R33.1 R36.2 U5.9(IN3+)
Net-(R37-2): R37.2 R38.2 U7.2(INA-)
Net-(R39-2): R39.2 R42.1 U5.11(IN4+)
Net-(R40-2): R40.2 R43.1 U5.10(IN4-)
Net-(R44-2): R44.2 R45.2 U7.6(INB-)
Net-(R46-1): R46.1 RJ1.3 RJ1.4
Net-(R49-2): R49.2 R51.1 R52.1 U8.3(1IN+)

Not connected (* = marked no-connect by the designer): PCB1 42(PB-5)* 43(PB-7)* 46(PB-6)* 47(PB-8)* 52(ADC-0)* 54(DIO-0)* 55(DIO-2)* 56(DIO-4)* 57(DIO-6)* 62(ADC-1)* 64(DIO-1)* 65(DIO-3)* 66(DIO-5)* 67(DIO-7)*; U2 6(GP4)* 11(GP8)* 16(GP12)* 34(GP28)* 35(VRef)* 37(3V3_En)* 41(SWLCK)* 42(GND)* 43(SWDIO)*; U8 7(2OUT)*

## Notes on the sheets
sheet 1
- LM339
sheet 2
- CAN
  Driver
- LCS Bus Connector
- Track Connector
- Bridge
  CTRL
- H-Bridge
- RC
  detector
- NVM
  Memory
- I2C
- Analog
  OpAmp
- MAIN
- Raspberry PI
  PICO ( R / W )
- Bridge
  CTRL
- H-Bridge
- RC
  detector
- LocoNet
  Interface
- Analog
  OpAmp
- PROG
- LocoNet
- I2C extern, etc.
- Extension Connector
- LEDs, Button
- Power Supply
- Power
- Power
sheet 3
- Non-Volatile Memory
- I2C Adr: 1010_000
- Non-Volatile Memory ( optional )
- I2C Adr: 1010_001
- CAN Bus Line Driver
- Ready
- Active
- Reset
- Level shifters
sheet 4
- Block Controller PCB connectors
- Power Supply with Powerfail Option
- *
- * optional, only for PFAIL option
- Optional 12V Power supply for LCS Bus and LocoNet bus
  ( if not needed, just leave out )
- Main
- Prog
sheet 5
- The LocNet interface is an optional component. If not used, just leave the PCB board empty for this function.
